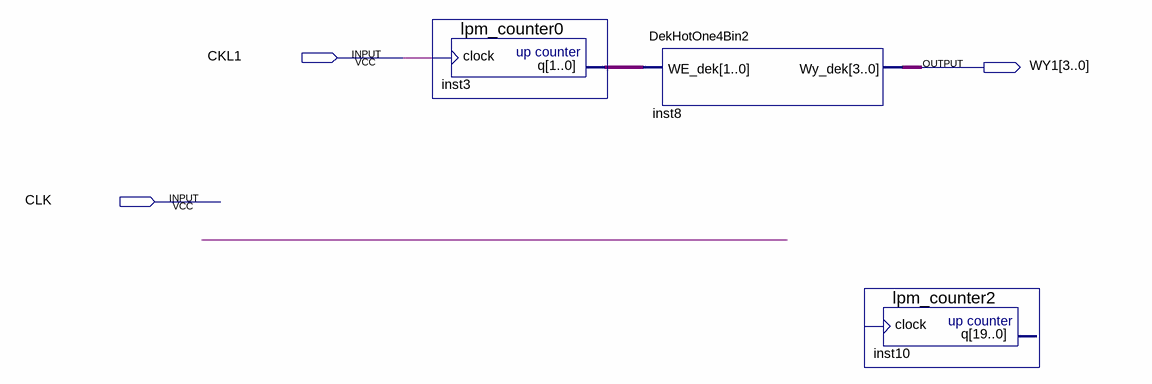
[diagram p0: schematic sheet]
// Quartus schematic Block1.bdf as structural Verilog: 3 symbols, 3 pins
module Block1 (
  input  CKL1,
  input  CLK,
  output [3:0] WY1
);

  wire [1:0] inst3_q;

  lpm_counter0 inst3 (.clock(CKL1), .q(inst3_q));
  DekHotOne4Bin2 inst8 (.WE_dek(inst3_q), .Wy_dek(WY1));
  lpm_counter2 inst10 ();  // open: clock, q
endmodule
